# Altium project ZIGBEE_CC2538+2592.PrjPcb
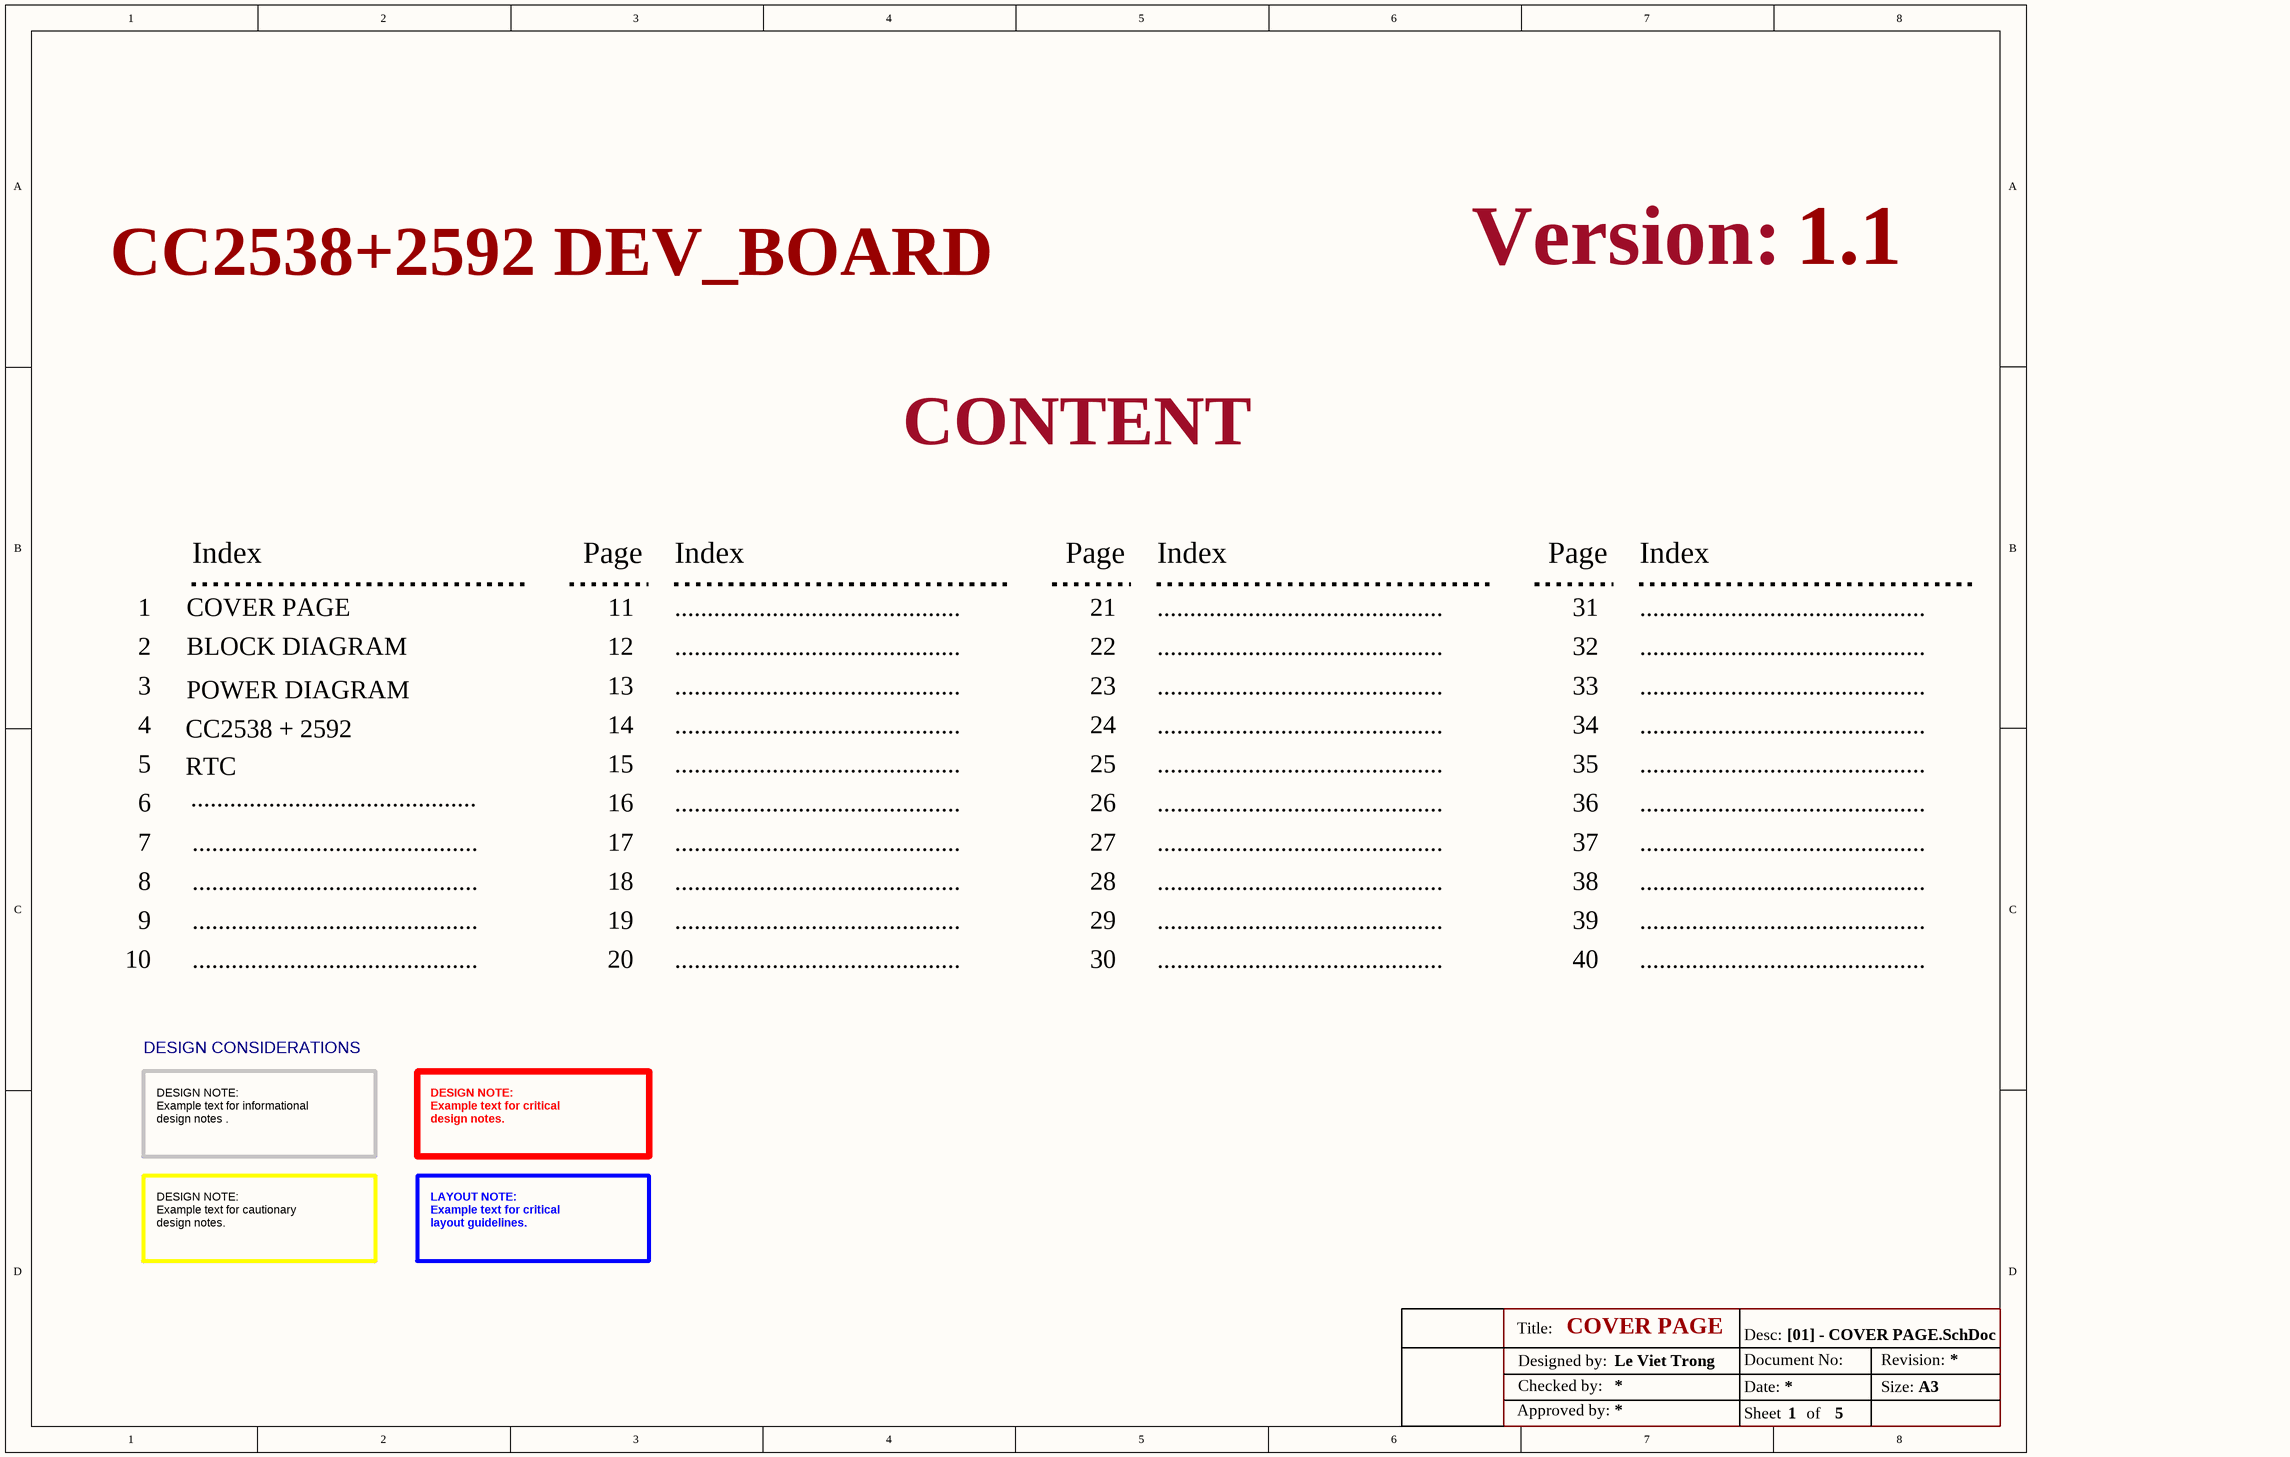
[diagram p0: [01] - COVER PAGE.SchDoc]
5 sheets, 82 parts. Net scope: global (net labels, ports and power ports of the same name join across sheets).
Board file: [CC2538+CC2592].PcbDoc
Sheets:
  [01] - COVER PAGE.SchDoc
  [02] - BLOCK DIAGRAM.SchDoc
  [03] - POWER DIAGRAM.SchDoc
  [04] - CC2538+CC2592.SchDoc
  [05] - RTC.SchDoc

## Sheet [01] - COVER PAGE.SchDoc: COVER PAGE
size A3; DrawnBy: Le Viet Trong; SheetNumber: 1; SheetTotal: 5

### Notes on the sheet
- CC2538+2592 DEV_BOARD
- Version:
- 1.1
- CONTENT
- Index
- Page
- 1
- COVER PAGE
- 11
- ............................................
- 21
- 31
- 2
- 3
- BLOCK DIAGRAM
- 12
- 13
- 22
- 23
- 32
- 33
- 4
- CC2538 + 2592
- POWER DIAGRAM
- 14
- 24
- 34
- 5
- 6
- RTC
- 15
- 16
- 25
- 26
- 35
- 36
- 7
- 8
- 17
- 18
- 27
- 28
- 37
- 38
- 9
- 19
- 29
- 39
- 10
- 20
- 30
- 40
- DESIGN CONSIDERATIONS
- DESIGN NOTE:
  Example text for informational
  design notes .
- DESIGN NOTE:
  Example text for critical
  design notes.
- DESIGN NOTE:
  Example text for cautionary
  design notes.
- LAYOUT NOTE:
  Example text for critical
  layout guidelines.
- Title:
- Desc:
- Designed by:
- Checked by:
- Date:
- Document No:
- Revision:
- Size:
- A3
- Approved by:
- Sheet
- of

## Sheet [02] - BLOCK DIAGRAM.SchDoc
size A; SheetNumber: 2; SheetTotal: 2

## Sheet [03] - POWER DIAGRAM.SchDoc: POWER DIAGRAM
size A; SheetNumber: 3; SheetTotal: 5
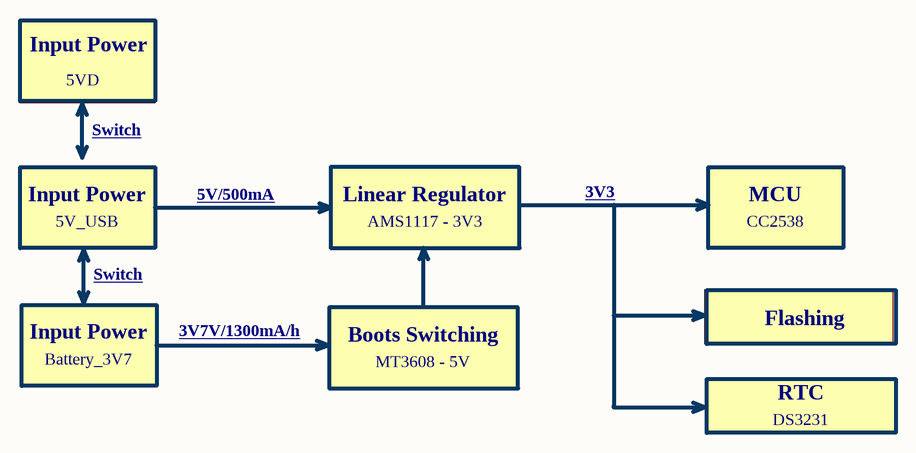
[diagram p1: [03] - POWER DIAGRAM.SchDoc]

### Notes on the sheet
- 5VD
- Input Power
- Switch
- 5V_USB
- 5V/500mA
- Linear Regulator
- AMS1117 - 3V3
- 3V3
- MCU
- CC2538
- 3V7V/1300mA/h
- Boots Switching
- Flashing
- Battery_3V7
- MT3608 - 5V
- RTC
- DS3231

## Sheet [04] - CC2538+CC2592.SchDoc: CC2538_DEV B
size A3; Date: 15/4/2025; ApprovedBy: Vo Que Son; DrawnBy: Le Viet Trong; SheetNumber: 4; SheetTotal: 5
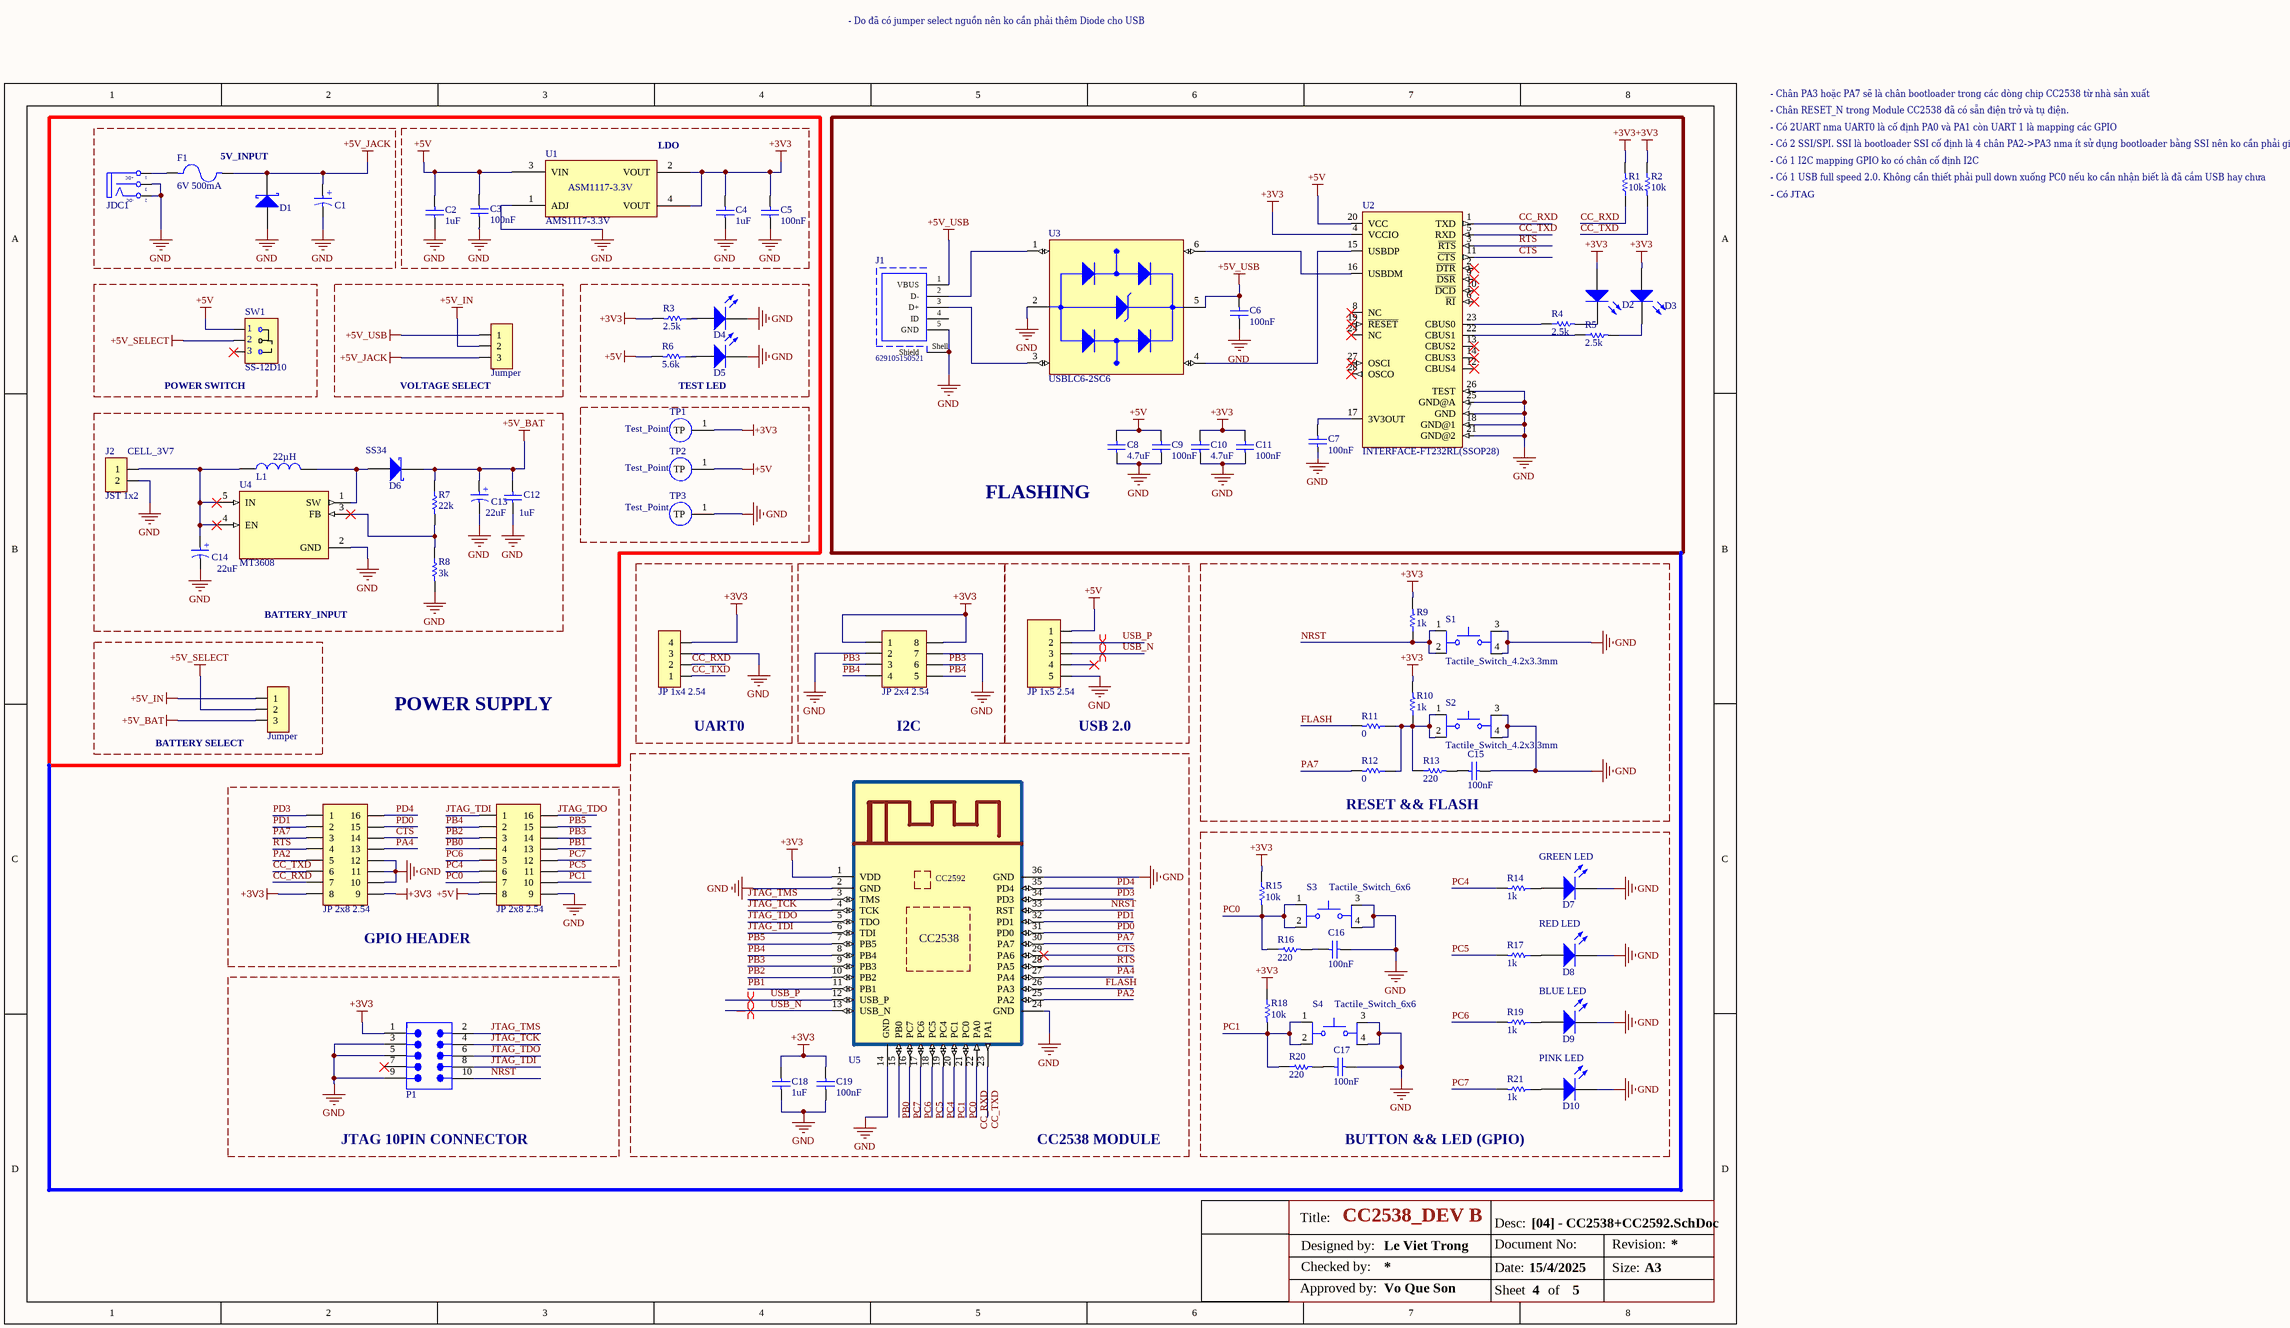
[diagram p2: [04] - CC2538+CC2592.SchDoc]

### Parts
C1  22uF  [WCAP-ASLI_D4H5.5]  (value not drawn)
C2  1uF  [CAP_0603]
C3  100nF  [CAP_0603]
C4  1uF  [CAP_0603]
C5  100nF  [CAP_0603]
C6  100nF  [CAP_0603]
C7  100nF  [CAP_0603]
C8  4.7uF  [CAP_0603]
C9  100nF  [CAP_0603]
C10  4.7uF  [CAP_0603]
C11  100nF  [CAP_0603]
C12  1uF  [CAP_0603]
C13  22uF  [WCAP-ASLI_D4H5.5]
C14  22uF  [WCAP-ASLI_D4H5.5]
C15  100nF  [CAP_0603]
C16  100nF  [CAP_0603]
C17  100nF  [CAP_0603]
C18  1uF  [CAP_0603]
C19  100nF  [CAP_0603]
D1  D Schottky  [SS34]  (value not drawn)
D2  LED SMD  [LED_0805_Blue]  (value not drawn)
D3  LED SMD  [LED_0805_Blue]  (value not drawn)
D4  LED SMD  [LED_0805_Blue]  (value not drawn)
D5  LED SMD  [LED_0805_Blue]  (value not drawn)
D6  SS34  [SS34]
D7  GREEN LED  [LED_0805_Blue]
D8  RED LED  [LED_0805_Blue]
D9  BLUE LED  [LED_0805_Blue]
D10  PINK LED  [LED_0805_Blue]
F1  6V 500mA  [PCBComponent_1]
J1  629105150521  [629105150521]
J2  JST 1x2  [XH 2,54M-2 SMT]
JDC1  Jack DC  [DC-IN]  (value not drawn)
JP1  Jumper  [JP 1x3 DT]
JP2  JP 1x5 2.54  [JP 1X5 DT]
JP3  JP 1x4 2.54  [JP 1X4 DT]
JP4  JP 2x4 2.54  [JP 2X4 DT]
JP5  Jumper  [JP 1x3 DT]
JP6  JP 2x8 2.54  [JP 2x8 DT]
JP7  JP 2x8 2.54  [JP 2x8 DT]
L1  22µH  [WE-PD2A_4532]
P1  62701021621  [62701021621]  (value not drawn)
R1  10k  [resistor_0603]
R2  10k  [resistor_0603]
R3  2.5k  [resistor_0603]
R4  2.5k  [resistor_0603]
R5  2.5k  [resistor_0603]
R6  5.6k  [resistor_0603]
R7  22k  [resistor_0603]
R8  3k  [resistor_0603]
R9  1k  [resistor_0603]
R10  1k  [resistor_0603]
R11  0  [resistor_0603]
R12  0  [resistor_0603]
R13  220  [resistor_0603]
R14  1k  [resistor_0603]
R15  10k  [resistor_0603]
R16  220  [resistor_0603]
R17  1k  [resistor_0603]
R18  10k  [resistor_0603]
R19  1k  [resistor_0603]
R20  220  [resistor_0603]
R21  1k  [resistor_0603]
S1  Tactile_Switch_4.2x3.3mm  [TACTILE_BUTTON_4.3X3.3]
S2  Tactile_Switch_4.2x3.3mm  [TACTILE_BUTTON_4.3X3.3]
S3  Tactile_Switch_6x6  [Tactile_Switch_6x6]
S4  Tactile_Switch_6x6  [Tactile_Switch_6x6]
SW1  SS-12D10  [Slide Switch]
TP1  Test_Point  [TP_2MM]
TP2  Test_Point  [TP_2MM]
TP3  Test_Point  [TP_2MM]
U1  AMS1117-3.3V  [AMS1117-3.3V SOT223]
U2  INTERFACE-FT232RL(SSOP28)  [SSOP28-0.65-10.2X5.2MM]
U3  USBLC6-2SC6  [SOT95P280X145-6N]
U4  MT3608  [SOT95P280X145-6N]
U5  CC253+CC2592  [CC2538_V1]  (value not drawn)

### Blocks framed on the sheet
POWER SUPPLY: C12-C14 D6 J2 L1 R7 R8 TP1-TP3 U4
5V_INPUT: C1 D1 F1 JDC1
LDO: C2-C5 U1
FLASHING: C6-C11 D2 D3 J1 R1 R2 R4 R5 U2 U3
POWER SWITCH: SW1
VOLTAGE SELECT: JP1
TEST LED: D4 D5 R3 R6
UART0: JP3
I2C: JP4
USB 2.0: JP2
RESET && FLASH: C15 R9-R13 S1 S2
BATTERY SELECT: JP5
CC2538 MODULE: C18 C19 U5
GPIO HEADER: JP6 JP7
BUTTON && LED (GPIO): C16 C17 D7-D10 R14-R21 S3 S4
JTAG 10PIN CONNECTOR: P1

### Nets
+3V3: C4.2 C5.2 C10.2 C11.2 C18.2 C19.2 D2.1(A) D3.1(A) JP3.4 JP4.1 JP4.8 JP6.8 JP6.9 P1.1 R1.2 R2.1 R3.2 R9.2 R10.2 R15.1 R18.1 TP1.1(TP) U1.2(VOUT) U1.4(VOUT) U2.4(VCCIO) U5.1(VDD)
+5V: C2.2 C3.2 C8.2 C9.2 JP2.1 JP7.8 R6.2 SW1.1 TP2.1(TP) U1.3(VIN) U2.20(VCC)
+5V_BAT: C12.2 C13.1(P) D6.2(K) JP5.3 R7.1
+5V_IN: JP1.2 JP5.1
+5V_JACK: C1.1(P) D1.2(K) F1.2 JP1.3
+5V_SELECT: JP5.2 SW1.2
+5V_USB: C6.2 J1.1(VBUS) JP1.1 U3.5(VBUS)
GND: C1.2(N) C2.1 C3.1 C4.1 C5.1 C6.1 C7.1 C8.1 C9.1 C10.1 C11.1 C12.1 C13.2(N) C14.2(N) C15.2 C16.2 C17.2 C18.1 C19.1 D1.1(A) D4.2(K) D5.2(K) D7.2(K) D8.2(K) D9.2(K) D10.2(K) J1.5(GND) J1.Shell(Shield) J2.2 JDC1.2(TN) JDC1.3(S) JP2.5 JP3.3 JP4.2 JP4.7 JP6.10 JP6.11 JP6.12 JP7.9 P1.3 P1.5 P1.9 R8.2 S1.3 S1.4 S2.3 S2.4 S3.3 S3.4 S4.3 S4.4 TP3.1(TP) U1.1(ADJ) U2.7(GND) U2.18(GND@1) U2.21(GND@2) U2.25(GND@A) U2.26(TEST) U3.2(GND) U4.2(GND) U5.2(GND) U5.14(GND) U5.24(GND) U5.36(GND)
CC_RXD: JP3.2 JP6.7 R1.1 U2.1(TXD) U5.22(PA0)
CC_TXD: JP3.1 JP6.6 R2.2 U2.5(RXD) U5.23(PA1)
CTS: JP6.14 U2.11(~{CTS}) U5.29(PA6)
FLASH: R11.2 U5.26(PA3)
JTAG_TCK: P1.4 U5.4(TCK)
JTAG_TDI: JP7.1 P1.8 U5.6(TDI)
JTAG_TDO: JP7.16 P1.6 U5.5(TDO)
JTAG_TMS: P1.2 U5.3(TMS)
NRST: P1.10 R9.1 S1.1 S1.2 U5.33(RST)
PA2: JP6.5 U5.25(PA2)
PA4: JP6.13 U5.27(PA4)
PA7: JP6.3 R12.2 U5.30(PA7)
PB0: JP7.4 U5.15(PB0)
PB1: JP7.13 U5.11(PB1)
PB2: JP7.3 U5.10(PB2)
PB3: JP4.3 JP4.6 JP7.14 U5.9(PB3)
PB4: JP4.4 JP4.5 JP7.2 U5.8(PB4)
PB5: JP7.15 U5.7(PB5)
PC0: JP7.7 R15.2 R16.1 S3.1 S3.2 U5.21(PC0)
PC1: JP7.10 R18.2 R20.1 S4.1 S4.2 U5.20(PC1)
PC4: JP7.6 R14.2 U5.19(PC4)
PC5: JP7.11 R17.2 U5.18(PC5)
PC6: JP7.5 R19.2 U5.17(PC6)
PC7: JP7.12 R21.2 U5.16(PC7)
PD0: JP6.15 U5.31(PD0)
PD1: JP6.2 U5.32(PD1)
PD3: JP6.1 U5.34(PD3)
PD4: JP6.16 U5.35(PD4)
RTS: JP6.4 U2.3(~{RTS}) U5.28(PA5)
USB_N: JP2.3 U5.13(USB_N)
USB_P: JP2.2 U5.12(USB_P)
NetC7_2: C7.2 U2.17(3V3OUT)
NetC14_1: C14.1(P) J2.1 L1.1 U4.4(EN) U4.5(IN)
NetC15_1: C15.1 R13.2
NetC16_1: C16.1 R16.2
NetC17_1: C17.1 R20.2
NetD2_2: D2.2(K) R4.2
NetD3_2: D3.2(K) R5.2
NetD4_1: D4.1(A) R3.1
NetD5_1: D5.1(A) R6.1
NetD6_1: D6.1(A) L1.2 U4.1(SW)
NetD7_1: D7.1(A) R14.1
NetD8_1: D8.1(A) R17.1
NetD9_1: D9.1(A) R19.1
NetD10_1: D10.1(A) R21.1
NetF1_1: F1.1 JDC1.1(T)
NetJ1_2: J1.2(D-) U3.1(I/O1_IN)
NetJ1_3: J1.3(D+) U3.3(I/O2_IN)
NetR4_1: R4.1 U2.23(CBUS0)
NetR5_1: R5.1 U2.22(CBUS1)
NetR7_2: R7.2 R8.1 U4.3(FB)
NetR10_1: R10.1 R11.1 R12.1 R13.1 S2.1 S2.2
NetU2_15: U2.15(USBDP) U3.4(I/O2_OUT)
NetU2_16: U2.16(USBDM) U3.6(I/O1_OUT)

Not connected (* = marked no-connect by the designer): J1 4(ID); JP2 4*; P1 7*; SW1 3*; U2 2(~{DTR})* 6(~{RI})* 8(NC)* 9(~{DSR})* 10(~{DCD})* 12(CBUS4)* 13(CBUS2)* 14(CBUS3)* 19(~{RESET})* 24(NC)* 27(OSCI)* 28(OSCO)*

### Layout directives
differential pair: USB_N, USB_P

### Notes on the sheet
- - Do đã có jumper select nguồn nên ko cần phải thêm Diode cho USB
- - Chân PA3 hoặc PA7 sẽ là chân bootloader trong các dòng chip CC2538 từ nhà sản xuất
- - Chân RESET_N trong Module CC2538 đã có sẵn điện trở và tụ điện.
- - Có 2UART nma UART0 là cố định PA0 và PA1 còn UART 1 là mapping các GPIO
- - Có 2 SSI/SPI. SSI là bootloader SSI cố định là 4 chân PA2->PA3 nma ít sử dụng bootloader bằng SSI nên ko cần phải giữ chân PA3. SPI còn lại Mapping
- - Có 1 I2C mapping GPIO ko có chân cố định I2C
- - Có 1 USB full speed 2.0. Không cần thiết phải pull down xuống PC0 nếu ko cần nhận biết là đã cắm USB hay chưa
- - Có JTAG
- (near J2) CELL_3V7
- BATTERY_INPUT
- Title:
- Desc:
- Designed by:
- Checked by:
- Date:
- Document No:
- Revision:
- Size:
- A3
- Approved by:
- Sheet
- of
- (in symbol 865080340003) +
- (in symbol AMS1117-3.3V) ASM1117-3.3V
- (in symbol CC253+CC2592) CC2592; CC2538
- (in symbol Jack DC) +DC; -DC

### Library data of the parts
C1 C13 C14 = 865080340003: V-Chip, D4 x H5.5mm, 22uF, 16V; Capacitance Tolerance: +/-20%; Dissipation Factor: 16%; Endurance: 2000h; Leakage Current: 3.52uA; Ripple Current: 90mA; Supply 1 Name: Mouser; Supply 1 SN: 710-865080340003; Supply 2 Name: thegioiic; Category: Aluminum Electrolytic Capacitors; ComponentLink2Description: Datasheet Link; ComponentLink2URL: https://www.we-online.com/redexpert/spec/865080340003?ad; Mount: Surface Mount; Operating Temperature Max: 105°C; Operating Temperature Min: -55°C; Packaging: Tape and Reel; Height: 5.5mm; Diameter: 4mm; Capacitance: 22uF; Rated Voltage (DC): 16V; Supply 1 URL: https://www.mouser.com/ProductDetail/Wurth-Elektronik/865080340003?qs=0KOYDY2FL2%252BowmC4S50IuQ%3D%3D; Supply 2 URL: https://www.thegioiic.com/tu-nhom-smd-22uf-16v-4x5-4mm
C2 C4 C12 C18 = 01060310510: CAP, size 0603, 1uF; Supply 1 SN: 885012206126; Supply 1 name: Wurth Elektronik; Supply 2 name: Thegioiic; Capacitance Tolerance: +/-10%; ComponentLink1Description: Manufacturer; ComponentLink1URL: http://www.we-online.de; ComponentLink2Description: Datasheet; ComponentLink2URL: https://www.we-online.com/components/products/datasheet/885012206126.pdf; Operating Temperature: -55 to +125degC; Packaging: Tape and Reel; Supply 1 URL: https://www.we-online.com/en/components/products/WCAP-CSGP-50VDC?sq=885012206126#885012206126; Supply 2 SN: *; Supply 2 URL: https://www.thegioiic.com/tu-gom-0603-1uf-50v; Dissipation Factor: *; Height: *; Mounting Technology: SMT; Size: 0603; Capacitance: 1uF; Technical Reference: *
C3 C5-C7 C9 C11 C15-C17 C19 = 01060310410: CAP, size 0603, 100nF; Supply 1 SN: 885012206095; Supply 1 name: Wurth Elektronik; Supply 2 name: Thegioiic; Capacitance Tolerance: +/-10%; ComponentLink1Description: Manufacturer; ComponentLink1URL: http://www.we-online.de; ComponentLink2Description: Datasheet; ComponentLink2URL: https://www.we-online.com/catalog/datasheet/885012206095.pdf; Operating Temperature: -55 to +125degC; Packaging: Tape and Reel; Supply 1 URL: https://www.we-online.com/en/components/products/WCAP-CSGP-50VDC?sq=885012206095R#885012206095R; Supply 2 SN: *; Supply 2 URL: https://www.thegioiic.com/tu-gom-0603-100nf-0-1uf-50v; Dissipation Factor: *; Height: *; Mounting Technology: SMT; Size: 0603; Capacitance: 100nF; Technical Reference: *
C8 C10 = 01060310410: CAP, size 0603, 4.7uF; Supply 1 SN: 885012206095; Supply 1 name: Wurth Elektronik; Supply 2 name: Thegioiic; Capacitance Tolerance: +/-10%; Capacitance: 100nF; ComponentLink1Description: Manufacturer; ComponentLink1URL: http://www.we-online.de; ComponentLink2Description: Datasheet; ComponentLink2URL: https://www.we-online.com/catalog/datasheet/885012206095.pdf; Operating Temperature: -55 to +125degC; Packaging: Tape and Reel; Supply 1 URL: https://www.we-online.com/en/components/products/WCAP-CSGP-50VDC?sq=885012206095R#885012206095R; Supply 2 SN: *; Supply 2 URL: https://www.thegioiic.com/tu-gom-0603-100nf-0-1uf-50v; Dissipation Factor: *; Height: *; Mounting Technology: SMT; Size: 0603; Technical Reference: *
D1 = D Schottky: Schottky Diode; Published: 8-Jun-2000; LatestRevisionDate: 17-Jul-2002; LatestRevisionNote: Re-released for DXP Platform.; PackageReference: SMB; Publisher: Altium Limited; PackageDescription: DO-214-AA/SMB; 2 C-Bend Leads; Body 5.3 x 3.6 mm, inc. leads (LxW); Code_JEDEC: DO-214-AA
D2-D5 D7-D10 = LED SMD: LED
D6 = D Schottky: Schottky Diode, SS34; Published: 8-Jun-2000; LatestRevisionDate: 17-Jul-2002; LatestRevisionNote: Re-released for DXP Platform.; PackageReference: SMB; Publisher: Altium Limited; PackageDescription: DO-214-AA/SMB; 2 C-Bend Leads; Body 5.3 x 3.6 mm, inc. leads (LxW); Code_JEDEC: DO-214-AA
F1 = 0805L050WR: 0805L050WR Cầu Chì Tự Phục Hồi 0805 6V 500mA; MP: MF-MSMF200-2; MF: Bourns; SnapEDA_Link: https://www.snapeda.com/parts/MF-MSMF200-2/Bourns/view-part/143366/?ref=snap; DigiKey-Purchase-URL: https://snapeda.com/shop?store=DigiKey&id=143366; Arrow_Electronics-Purchase-URL: https://snapeda.com/shop?store=Arrow+Electronics&id=143366; Availability: Good; Package: 1812 Bourns; Mouser-Purchase-URL: https://snapeda.com/shop?store=Mouser&id=143366; Price: None; Value: *
J1 = 629105150521: Micro USB 2.0 Type B Receptacle WR-COM, Horizontal, SMT, with Pegs, High Current at Pin 1 & Pin 5; Rated Current: 3 A; Contact Resistance: 30 mOhm; Working Voltage: 30 VAC; ComponentLink1Description: Manufacturer; ComponentLink1URL: http://www.we-online.de; ComponentLink2Description: Datasheet; ComponentLink2URL: https://katalog.we-online.de/em/datasheet/629105150521.pdf; Part Number: 629105150521; Published Date: September 2018; Publisher: Wurth Elektronik; Orientation: Horizontal; Connector Type: Micro USB 2.0 Type B; Operating Temperature: -40 to 85 degC; Mounting Technology: SMT; Gender: Receptacle; Packaging: Tape and Reel
J2 = JST 2.54mm 1x2 SMT: Đầu XH2.54mm 2 Chân Dán SMD Nằm Ngang
JDC1 = Jack DC: Jack DC input; Value: Jac DC
JP1 JP5 = JP 1x3 2.54 Duc Thang: Cắm; Ten_Linh_Kien: Jump Đơn Đực 2.54MM 1x40P Thẳng 11MM; Don_Vi: Con; Ma_Hang: MH000903; Ghi_Chu: *; Kieu_Chan: *; Chung_Loai: Cắm
JP2 = JP 1x5 2.54 Duc Cong: Cắm; Ten_Linh_Kien: Jump Đơn Đực 2.54MM 1x40P Cong Đứng; Don_Vi: Con; Ma_Hang: MH000904; Ghi_Chu: *; Kieu_Chan: *; Chung_Loai: Cắm
JP3 = JP 1x4 2.54 Duc Cong: Cắm; Ten_Linh_Kien: Jump Đơn Đực 2.54MM 1x40P Cong Đứng; Don_Vi: Con; Ma_Hang: MH000904; Ghi_Chu: *; Kieu_Chan: *; Chung_Loai: Cắm
JP4 = JP 2x4 2.54 Duc Cong: Cắm; Ten_Linh_Kien: Jump Đôi Đực 2.54MM 2x40P Cong; Don_Vi: Con; Ma_Hang: MH005385; Ghi_Chu: *; Kieu_Chan: *; Chung_Loai: Cắm
JP6 JP7 = JP 2x8 2.54 Duc Thang: Cắm; Ten_Linh_Kien: Jump Đôi Đực 2.54MM 2x40P Thẳng 11MM; Don_Vi: Con; Ma_Hang: MH002686; Ghi_Chu: *; Kieu_Chan: *; Chung_Loai: Cắm
L1 = CD43 INDUCTOR: WE-PD2A SMT Power Inductor, size CD43, 22µH; Manufacturer Part Number: 7847730; Manufacturer: Wurth Elektronik; Case/Size Code: 4532; DC Resistance: 0.014Ω; DC Resistance Max: 0.049Ω; Inductance: 1µH; Rated Current: 4A; Rated Voltage: 80VDC; Saturation Current: 5.72A; Self Resonant Frequency: 110MHz; Category: Single Coil Power Inductors; Match Code: WE-PD2A; ComponentLink1Description: Website Link; ComponentLink1URL: https://www.we-online.com/redexpert/article/7847730?ad; ComponentLink2Description: Datasheet Link; ComponentLink2URL: https://www.we-online.com/redexpert/spec/7847730?ad; Mount: Surface Mount; Operating Temperature Max: 125°C; Operating Temperature Min: -40°C; Packaging: Tape and Reel; Length: 4.5mm; Width: 4mm; Height: 3.2mm; Automotive: Yes
P1 = 62701021621: WR-BHD Male Box Header, THT Straight, pitch 1.27mm, 2 row, 10 pin; Manufacturer: Wurth Elektronik; Contact Resistance: 20mOhm; Insulation Resistance: 1000MOhm; Rated Current: 1A; Working Voltage: 50V; Withstanding Voltage: 500V; Manufacturer Part Number: 62701021621; Category: Wire-to-Board Connectors; Match Code: WR-BHD; ComponentLink1Description: Website Link; ComponentLink1URL: https://www.we-online.com/redexpert/article/62701021621?ad; ComponentLink2Description: Datasheet Link; ComponentLink2URL: https://www.we-online.com/redexpert/spec/62701021621?ad; Mount: Through Hole; Operating Temperature Max: 105°C; Operating Temperature Min: -40°C; Packaging: Tube; Length: 12.7mm; Width: 5mm; Height: 4.9mm; Gender: Male; Number of Pins: 10; Number of Rows: 2; Orientation: Straight; Pitch: 1.27mm
R1 R2 = 0006032525: RES, 10K Ohm, size 0603, 5%; Resistance tolerance: +/-5%; Rated Power: 1/4 W; Resistance: 2.5K; Size: 0603; Mounting Technology: SMT; Datasheet: *; ComponentLink1Description: Datasheet link; ComponentLink1URL: *; Supply 1 Name: *; Supply 1 SN: *; Supply 1 URL: *; Supply 2 Name: *; Supply 2 SN: *; Supply 2 URL: *; Supply 3 Name: *; Supply 3 SN: *; Supply 3 URL: *; Manufacture  Name: *; Manufacture  SN: *
R3-R5 = 0006032525: RES, 2.5K Ohm, size 0603, 5%; Resistance tolerance: +/-5%; Rated Power: 1/4 W; Size: 0603; Mounting Technology: SMT; Datasheet: *; Resistance: 2.5K; ComponentLink1Description: Datasheet link; ComponentLink1URL: *; Supply 1 Name: *; Supply 1 SN: *; Supply 1 URL: *; Supply 2 Name: *; Supply 2 SN: *; Supply 2 URL: *; Supply 3 Name: *; Supply 3 SN: *; Supply 3 URL: *; Manufacture  Name: *; Manufacture  SN: *
R6 = 0006035621: RES, 5.6k Ohm, size 0603, 1%; Resistance Tolerant: +/-1%; Rated Power: 1/4W; Supply 1 Name: Mouser; Supply 1 SN: 667-ERJ-UP3F5601V; Supply 2 Name: Digikey; Supply 2 SN: 10-ERJ-UP3F5601VTR-ND 10-ERJ-UP3F5601VCT-ND 10-ERJ-UP3F5601VDKR-ND; Resistance: 5.6k; Size: 0603; Mounting Technology: SMT; ComponentLink1Description: Datasheet link; ComponentLink1URL: https://api.pim.na.industrial.panasonic.com/file_stream/main/fileversion/4484; ComponentLink2Description: Supply 1 URL; ComponentLink2URL: https://www.mouser.vn/ProductDetail/Panasonic/ERJ-UP3F5601V?qs=sGAEpiMZZMvdGkrng054twq3eZrCFN89ezYxgAsnxBTZYD17cS%252B65A%3D%3D; ComponentLink3Description: Supply 2 URL; ComponentLink3URL: https://www.digikey.com/en/products/detail/panasonic-electronic-components/ERJ-UP3F5601V/12092890
R7 = 0006035621: RES, 22k Ohm, size 0603, 1%; Resistance: 5.6k; Resistance Tolerant: +/-1%; Rated Power: 1/4W; Supply 1 Name: Mouser; Supply 1 SN: 667-ERJ-UP3F5601V; Supply 2 Name: Digikey; Supply 2 SN: 10-ERJ-UP3F5601VTR-ND 10-ERJ-UP3F5601VCT-ND 10-ERJ-UP3F5601VDKR-ND; Size: 0603; Mounting Technology: SMT; ComponentLink1Description: Datasheet link; ComponentLink1URL: https://api.pim.na.industrial.panasonic.com/file_stream/main/fileversion/4484; ComponentLink2Description: Supply 1 URL; ComponentLink2URL: https://www.mouser.vn/ProductDetail/Panasonic/ERJ-UP3F5601V?qs=sGAEpiMZZMvdGkrng054twq3eZrCFN89ezYxgAsnxBTZYD17cS%252B65A%3D%3D; ComponentLink3Description: Supply 2 URL; ComponentLink3URL: https://www.digikey.com/en/products/detail/panasonic-electronic-components/ERJ-UP3F5601V/12092890
R8 = 0006032525: RES, 3K Ohm, size 0603, 5%; Resistance tolerance: +/-5%; Rated Power: 1/4 W; Resistance: 2.5K; Size: 0603; Mounting Technology: SMT; Datasheet: *; ComponentLink1Description: Datasheet link; ComponentLink1URL: *; Supply 1 Name: *; Supply 1 SN: *; Supply 1 URL: *; Supply 2 Name: *; Supply 2 SN: *; Supply 2 URL: *; Supply 3 Name: *; Supply 3 SN: *; Supply 3 URL: *; Manufacture  Name: *; Manufacture  SN: *
R9 R10 R14 R17 R19 R21 = 0006031031: RES, 1k Ohm, size 0603, 1%; Resistance: 10k; Resistance Tolerant: +/-1%; Rated Power: 1/4W; Supply 1 Name: Mouser; Supply 1 SN: 755-ESR03EZPF1002; Supply 2 Name: Digikey; Supply 2 SN: RHM10KADTR-ND RHM10KADCT-ND RHM10KADDKR-ND; Size: 0603; Mounting Technology: SMT; ComponentLink1Description: Datasheet link; ComponentLink1URL: https://fscdn.rohm.com/en/products/databook/datasheet/passive/resistor/chip_resistor/esr-e.pdf; ComponentLink2Description: Supply 1 URL; ComponentLink2URL: https://www.mouser.vn/ProductDetail/ROHM-Semiconductor/ESR03EZPF1002?qs=sGAEpiMZZMvdGkrng054t67Efho1F8r6CDeAsqwFse8%3D; ComponentLink3Description: Supply 2 URL; ComponentLink3URL: https://www.digikey.com/en/products/detail/rohm-semiconductor/ESR03EZPF1002/1983429
R11 R12 = 0006030001: RES, 0 Ohm, size 0603, 1%; Resistance tolerance: +/-5%; Rated Power: 1/4 W; Resistance: 2.5K; Size: 0603; Mounting Technology: SMT; Datasheet: *; ComponentLink1Description: Datasheet link; ComponentLink1URL: *; Supply 1 Name: *; Supply 1 SN: *; Supply 1 URL: *; Supply 2 Name: *; Supply 2 SN: *; Supply 2 URL: *; Supply 3 Name: *; Supply 3 SN: *; Supply 3 URL: *; Manufacture  Name: *; Manufacture  SN: *
R13 R16 R20 = 0006031031: RES, 220 Ohm, size 0603, 1%; Resistance: 10k; Resistance Tolerant: +/-1%; Rated Power: 1/4W; Supply 1 Name: Mouser; Supply 1 SN: 755-ESR03EZPF1002; Supply 2 Name: Digikey; Supply 2 SN: RHM10KADTR-ND RHM10KADCT-ND RHM10KADDKR-ND; Size: 0603; Mounting Technology: SMT; ComponentLink1Description: Datasheet link; ComponentLink1URL: https://fscdn.rohm.com/en/products/databook/datasheet/passive/resistor/chip_resistor/esr-e.pdf; ComponentLink2Description: Supply 1 URL; ComponentLink2URL: https://www.mouser.vn/ProductDetail/ROHM-Semiconductor/ESR03EZPF1002?qs=sGAEpiMZZMvdGkrng054t67Efho1F8r6CDeAsqwFse8%3D; ComponentLink3Description: Supply 2 URL; ComponentLink3URL: https://www.digikey.com/en/products/detail/rohm-semiconductor/ESR03EZPF1002/1983429
R15 R18 = 0006031031: RES, 10k Ohm, size 0603, 1%; Resistance Tolerant: +/-1%; Rated Power: 1/4W; Supply 1 Name: Mouser; Supply 1 SN: 755-ESR03EZPF1002; Supply 2 Name: Digikey; Supply 2 SN: RHM10KADTR-ND RHM10KADCT-ND RHM10KADDKR-ND; Resistance: 10k; Size: 0603; Mounting Technology: SMT; ComponentLink1Description: Datasheet link; ComponentLink1URL: https://fscdn.rohm.com/en/products/databook/datasheet/passive/resistor/chip_resistor/esr-e.pdf; ComponentLink2Description: Supply 1 URL; ComponentLink2URL: https://www.mouser.vn/ProductDetail/ROHM-Semiconductor/ESR03EZPF1002?qs=sGAEpiMZZMvdGkrng054t67Efho1F8r6CDeAsqwFse8%3D; ComponentLink3Description: Supply 2 URL; ComponentLink3URL: https://www.digikey.com/en/products/detail/rohm-semiconductor/ESR03EZPF1002/1983429
S1 S2 = Tactile_Switch_4.2x3.3mm: Nút Nhấn 4.2x3.3mm Cao 2.5mm 4 Chân SMD V1
S3 S4 = Tactile_Switch_6x6: Tactile Switch, 6x6mm
SW1 = SS-12D10: SS-12D10 Công Tắc Trượt 3 Chân Xuyên Lỗ ON-OFF 1P2T 0.5A
TP1-TP3 = Test_Point: Test point, 2mm radius
U1 = AMS1117-3.3V: AMS1117-3.3V, OUT 3.3V 1A.; Manufacturer: AMS; Pad Count: 4; Current Output Maximum: 1A; Voltage Input Maximum: 15V; Manufacturer Part Number: *; Part Number: *; Current Input Maximum: *; Supplier 1 Link: *; Supplier 1 Name: *; Supplier 2 Link: *; Supplier 2 Name: *; Supplier 2 Part Number: *; Supplier 3 Link: https://www.thegioiic.com/ams1117-3-3v-ic-on-ap-3-3v-1a-sot-223; Supplier 3 Name: ThegioiIC; Supplier 3 Part Number: *; Voltage Output: 3.3V; Mounting Technology: SMD; Supplier 1 Part Number: *; Datasheet: http://www.advanced-monolithic.com/pdf/ds1117.pdf
U2 = INTERFACE-FT232RL(SSOP28): USB Bridge, USB to UART USB 2.0 UART Interface 28-SSOP; MF: FTDI, Future; SnapEDA_Link: https://www.snapeda.com/parts/FT232RL/FTDI%252C+Future+Technology+Devices+International+Ltd/view-part/?ref=snap; Package: SSOP-28 FTDI; Value: *; MP: FT232RL; Check_prices: https://www.snapeda.com/parts/FT232RL/FTDI%252C+Future+Technology+Devices+International+Ltd/view-part/?ref=eda
U3 = USBLC6-2SC6: 17V Clamp 5A (8/20Âµs) Ipp Tvs Diode Surface Mount SOT-23-6; MF: STMicroelectronics; Value: *; SnapEDA_Link: https://www.snapeda.com/parts/USBLC6-2SC6/STMicroelectronics/view-part/?ref=snap; Check_prices: https://www.snapeda.com/parts/USBLC6-2SC6/STMicroelectronics/view-part/?ref=eda; Purchase-URL: https://pricing.snapeda.com/search/part/USBLC6-2SC6/?ref=eda; Price: None; Availability: In Stock; Package: SOT-23-6 STMicroelectronics; MP: USBLC6-2SC6
U4 = MT3608: High Efficiency 1.2MHz2A Step Up Converter; MF: Aerosemi Technology Co., Ltd; Price: None; Availability: Not in stock; Package: Package; MP: MT3608; Value: *; SnapEDA_Link: https://www.snapeda.com/parts/MT3608/Aerosemi+Technology+Co.%252C+Ltd/view-part/?ref=snap; Check_prices: https://www.snapeda.com/parts/MT3608/Aerosemi+Technology+Co.%252C+Ltd/view-part/?ref=eda
U5 = CC253+CC2592: WAVGAT CC2538 + CC2592 module Communication distance Support zigbee/6lowpan

## Sheet [05] - RTC.SchDoc: RTC
size A3; Date: 15/4/2025; ApprovedBy: Vo Que Son; DrawnBy: Le Viet Trong; SheetNumber: 5; SheetTotal: 5
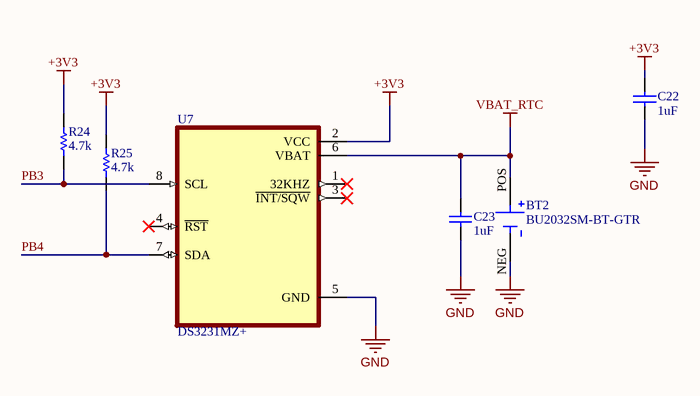
[diagram p3: [05] - RTC.SchDoc]

### Parts
BT2  BU2032SM-BT-GTR  [BAT_BU2032SM-BT-GTR]
C22  1uF  [CAP_0603]
C23  1uF  [CAP_0603]
R24  4.7k  [resistor_0603]
R25  4.7k  [resistor_0603]
U7  DS3231MZ+  [SOIC127P600X175-8N]

### Nets
+3V3: C22.2 R24.1 R25.1 U7.2(VCC)
GND: BT2.NEG C22.1 C23.1 U7.5(GND)
VBAT_RTC: BT2.POS C23.2 U7.6(VBAT)
PB3: R24.2 U7.8(SCL)
PB4: R25.2 U7.7(SDA)

Not connected (* = marked no-connect by the designer): U7 1(32KHZ)* 3(~{INT/SQW})* 4(~{RST})*

### Notes on the sheet
- Title:
- Desc:
- Designed by:
- Checked by:
- Date:
- Document No:
- Revision:
- Size:
- A3
- Approved by:
- Sheet
- of

### Library data of the parts
BT2 = BU2032SM-BT-GTR: Battery Holder (Open) Coin, 20.0mm 1 Cell SMD (SMT) Tab; MF: Memory Protection Devices; SnapEDA_Link: https://www.snapeda.com/parts/BU2032SM-BT-GTR/Memory+Protection+Devices/view-part/?ref=snap; Package: None; Value: *; MP: BU2032SM-BT-GTR; Check_prices: https://www.snapeda.com/parts/BU2032SM-BT-GTR/Memory+Protection+Devices/view-part/?ref=eda
C22 C23 = 01060310510: as C2 on sheet [04] - CC2538+CC2592; ComponentLink1Description: Manufacturer; ComponentLink1URL: http://www.we-online.de; ComponentLink2Description: Datasheet; ComponentLink2URL: https://www.we-online.com/components/products/datasheet/885012206126.pdf; Operating Temperature: -55 to +125degC; Packaging: Tape and Reel; Supply 1 URL: https://www.we-online.com/en/components/products/WCAP-CSGP-50VDC?sq=885012206126#885012206126; Supply 2 SN: *; Supply 2 URL: https://www.thegioiic.com/tu-gom-0603-1uf-50v; Dissipation Factor: *; Height: *; Mounting Technology: SMT; Size: 0603; Capacitance: 1uF; Technical Reference: *
R24 R25 = 0006031031: RES, 4.7k Ohm, size 0603, 1%; Resistance: 10k; Resistance Tolerant: +/-1%; Rated Power: 1/4W; Supply 1 Name: Mouser; Supply 1 SN: 755-ESR03EZPF1002; Supply 2 Name: Digikey; Supply 2 SN: RHM10KADTR-ND RHM10KADCT-ND RHM10KADDKR-ND; Size: 0603; Mounting Technology: SMT; ComponentLink1Description: Datasheet link; ComponentLink1URL: https://fscdn.rohm.com/en/products/databook/datasheet/passive/resistor/chip_resistor/esr-e.pdf; ComponentLink2Description: Supply 1 URL; ComponentLink2URL: https://www.mouser.vn/ProductDetail/ROHM-Semiconductor/ESR03EZPF1002?qs=sGAEpiMZZMvdGkrng054t67Efho1F8r6CDeAsqwFse8%3D; ComponentLink3Description: Supply 2 URL; ComponentLink3URL: https://www.digikey.com/en/products/detail/rohm-semiconductor/ESR03EZPF1002/1983429
U7 = DS3231MZ+: Â±5ppm, I2C Real-Time Clock; MF: Analog Devices; SnapEDA_Link: https://www.snapeda.com/parts/DS3231MZ+/Analog+Devices/view-part/?ref=snap; Package: SOIC-8 Maxim; Value: *; MP: DS3231MZ+; Check_prices: https://www.snapeda.com/parts/DS3231MZ+/Analog+Devices/view-part/?ref=eda

## Nets that join several sheets
+3V3: [04] - CC2538+CC2592 (26 pins), [05] - RTC (C22.2 R24.1 R25.1 U7.2)
GND: [04] - CC2538+CC2592 (64 pins), [05] - RTC (BT2.NEG C22.1 C23.1 U7.5)
PB3: [04] - CC2538+CC2592 (JP4.3 JP4.6 JP7.14 U5.9), [05] - RTC (R24.2 U7.8)
PB4: [04] - CC2538+CC2592 (JP4.4 JP4.5 JP7.2 U5.8), [05] - RTC (R25.2 U7.7)